# Altium schematic sheet HS-IO ESP32.SchDoc
size A3; SheetNumber: 3; SheetTotal: 3
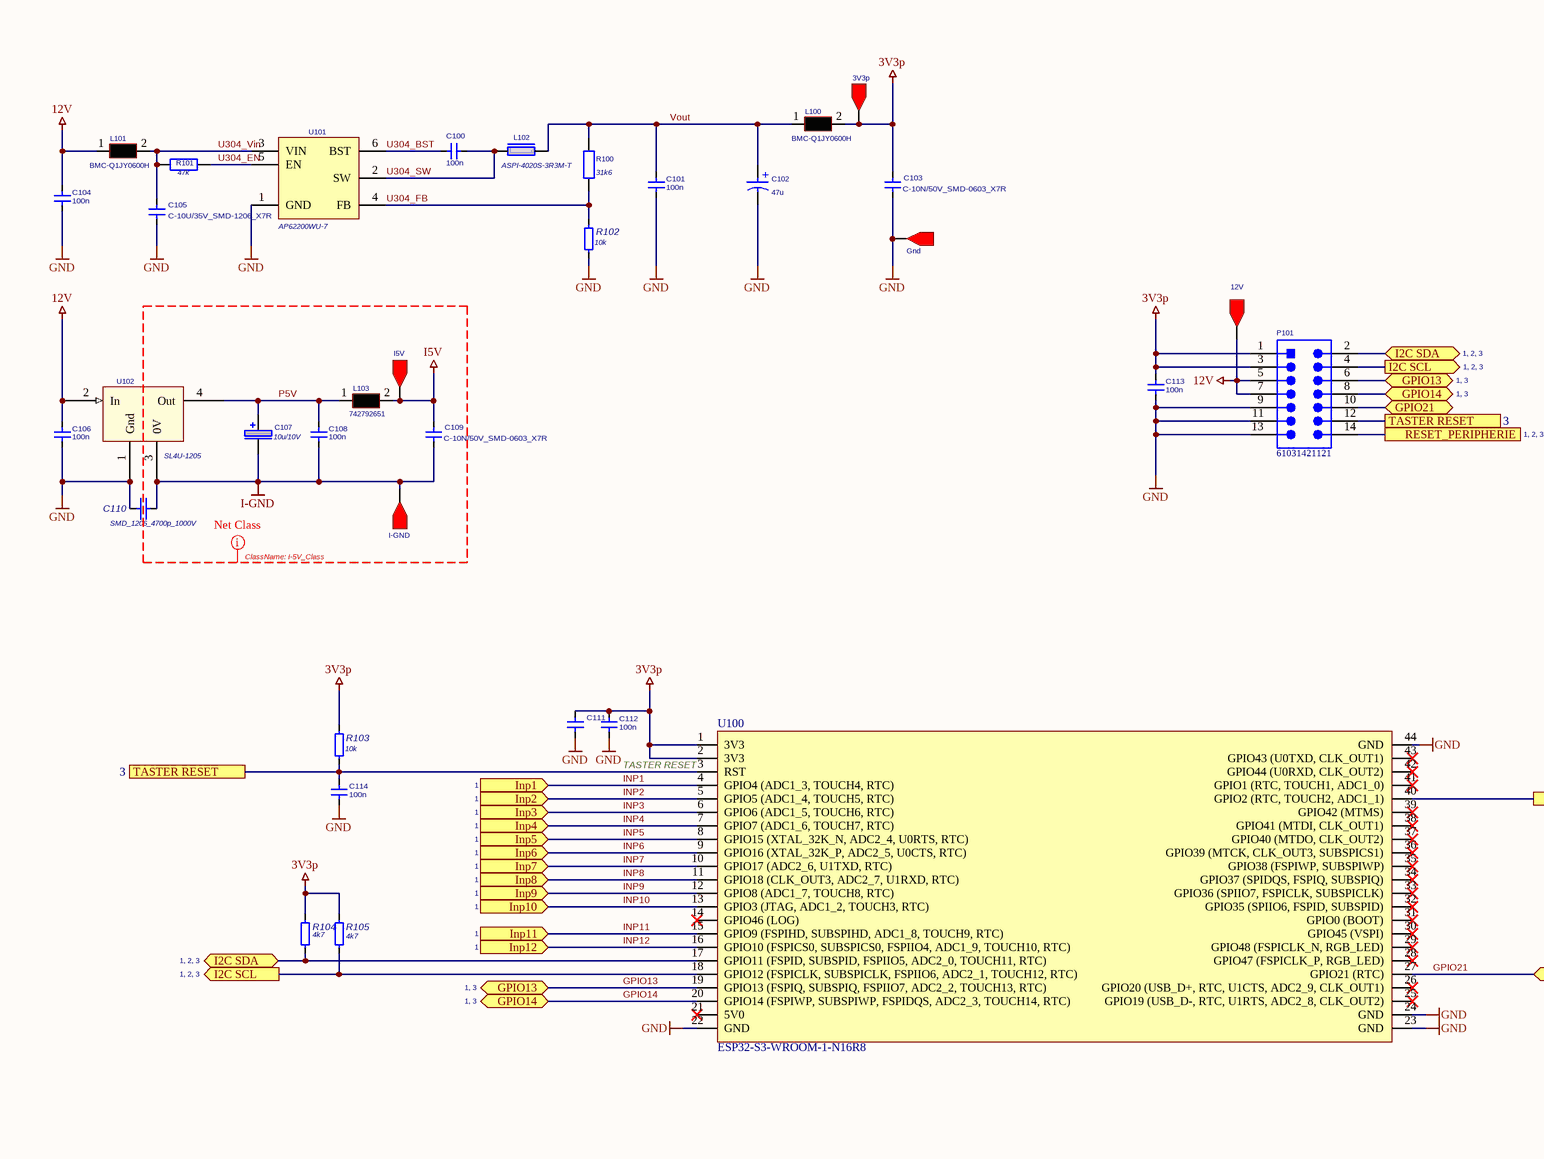
[diagram p0: HS-IO ESP32.SchDoc, left]
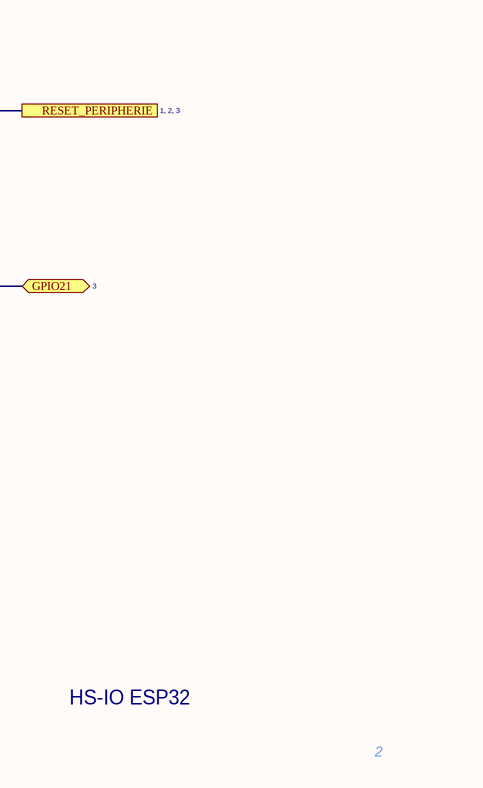
[diagram p1: HS-IO ESP32.SchDoc, right]

## Parts
3V3p  (no part)  [TESTPOINT]  (value not drawn)  (no BOM)
12V  (no part)  [TESTPOINT]  (value not drawn)  (no BOM)
C100  100n  [CC1608-0603]
C101  100n  [CC1608-0603]
C102  47u  [WCAP-PSLP_D5H5.5]
C103  C-10N/50V_SMD-0603_X7R  [0603_SMD_T]
C104  100n  [CC1608-0603]
C105  C-10U/35V_SMD-1206_X7R  [1206C_H0175_SMD_T]
C106  100n  [CC1608-0603]
C107  10u/10V  [TA-C]
C108  100n  [CC1608-0603]
C109  C-10N/50V_SMD-0603_X7R  [0603_SMD_T]
C110  SMD_1206_4700p_1000V  [CR3216-1206]
C111  C-10U/10V_SMD-0603_X5R  [CC1608-0603]  (value not drawn)
C112  100n  [CC1608-0603]
C113  100n  [CC1608-0603]
C114  100n  [CC1608-0603]
Gnd  (no part)  [TESTPOINT]  (value not drawn)  (no BOM)
I5V  (no part)  [TESTPOINT]  (value not drawn)  (no BOM)
I-GND  (no part)  [TESTPOINT]  (value not drawn)  (no BOM)
L100  BMC-Q1JY0600H  [0603-Ferrit]
L101  BMC-Q1JY0600H  [0603-Ferrit]
L102  ASPI-4020S-3R3M-T  [ASPI-4020S]
L103  742792651  [0603-Ferrit]
P101  61031421121  [61031421121]
R100  31k6  [CR1608-0603]
R101  47k  [CR1608-0603]
R102  10k  [CR1608-0603]
R103  10k  [CR1608-0603]
R104  4k7  [CC1608-0603]
R105  4k7  [CC1608-0603]
U100  ESP32-S3-WROOM-1-N16R8  [DIL-44-ESP32]
U101  AP62200WU-7  [SOT95P280X100-6N]
U102  SL4U-1205  [SIP4_6mm]

## Ports
GPIO13 (bidir, see 1, 3), GPIO14 (bidir, see 1, 3), GPIO21 (bidir, see 3), I2C SCL (out, see 1, 2, 3), I2C SDA (bidir, see 1, 2, 3), Inp1 (in, see 1), Inp2 (in, see 1), Inp3 (in, see 1), Inp4 (in, see 1), Inp5 (in, see 1), Inp6 (in, see 1), Inp7 (in, see 1), Inp8 (in, see 1), Inp9 (in, see 1), Inp10 (in, see 1), Inp11 (in, see 1), Inp12 (in, see 1), RESET_PERIPHERIE (see 1, 2, 3), TASTER RESET (see 3)

## Nets
3V3p: 3V3p.1 C103.1 C111.1 C112.2 C113.2 L100.2 P101.1 P101.3 R103.2 R104.2 R105.2 U100.1(3V3) U100.2(3V3)
12V: 12V.1 C104.1 C106.2 L101.1 P101.5 P101.7 U102.2(In)
GND: C101.1 C102.2(N) C103.2 C104.2 C105.2 C106.1 C110.1 C111.2 C112.1 C113.1 C114.1 Gnd.1 P101.9 P101.11 P101.13 R102.1 U100.22(GND) U100.23(GND) U100.24(GND) U100.44(GND) U101.1(GND) U102.1(Gnd)
I5V: C109.1 I5V.1 L103.2
I-GND: C107.2 C108.1 C109.2 C110.2 I-GND.1 U102.3(0V)
GPIO13: P101.6 U100.19(GPIO13_(FSPIQ,_SUBSPIQ,_FSPIIO7,_ADC2_2,_TOUCH13,_RTC)) ; port GPIO13
GPIO14: P101.8 U100.20(GPIO14_(FSPIWP,_SUBSPIWP,_FSPIDQS,_ADC2_3,_TOUCH14,_RTC)) ; port GPIO14
GPIO21: P101.10 U100.27(GPIO21_(RTC)) ; port GPIO21
I2C SCL: P101.4 R105.1 U100.18(GPIO12_(FSPICLK,_SUBSPICLK,_FSPIIO6,_ADC2_1,_TOUCH12,_RTC)) ; port I2C SCL
I2C SDA: P101.2 R104.1 U100.17(GPIO11_(FSPID,_SUBSPID,_FSPIIO5,_ADC2_0,_TOUCH11,_RTC)) ; port I2C SDA
INP1: U100.4(GPIO4_(ADC1_3,_TOUCH4,_RTC)) ; port Inp1
INP2: U100.5(GPIO5_(ADC1_4,_TOUCH5,_RTC)) ; port Inp2
INP3: U100.6(GPIO6_(ADC1_5,_TOUCH6,_RTC)) ; port Inp3
INP4: U100.7(GPIO7_(ADC1_6,_TOUCH7,_RTC)) ; port Inp4
INP5: U100.8(GPIO15_(XTAL_32K_N,_ADC2_4,_U0RTS,_RTC)) ; port Inp5
INP6: U100.9(GPIO16_(XTAL_32K_P,_ADC2_5,_U0CTS,_RTC)) ; port Inp6
INP7: U100.10(GPIO17_(ADC2_6,_U1TXD,_RTC)) ; port Inp7
INP8: U100.11(GPIO18_(CLK_OUT3,_ADC2_7,_U1RXD,_RTC)) ; port Inp8
INP9: U100.12(GPIO8_(ADC1_7,_TOUCH8,_RTC)) ; port Inp9
INP10: U100.13(GPIO3_(JTAG,_ADC1_2,_TOUCH3,_RTC)) ; port Inp10
INP11: U100.15(GPIO9_(FSPIHD,_SUBSPIHD,_ADC1_8,_TOUCH9,_RTC)) ; port Inp11
INP12: U100.16(GPIO10_(FSPICS0,_SUBSPICS0,_FSPIIO4,_ADC1_9,_TOUCH10,_RTC)) ; port Inp12
P5V: C107.1 C108.2 L103.1 U102.4(Out)
RESET_PERIPHERIE: P101.14 U100.40(GPIO2_(RTC,_TOUCH2,_ADC1_1)) ; port RESET_PERIPHERIE
TASTER RESET: C114.2 P101.12 R103.1 U100.3(RST) ; port TASTER RESET
U304_BST: C100.1 U101.6(BST)
U304_EN: R101.1 U101.5(EN)
U304_FB: R100.1 R102.2 U101.4(FB)
U304_SW: C100.2 L102.1 U101.2(SW)
U304_Vin: C105.1 L101.2 R101.2 U101.3(VIN)
Vout: C101.2 C102.1(P) L100.1 L102.2 R100.2

Not connected (* = marked no-connect by the designer): U100 14(GPIO46_(LOG))* 21(5V0)* 25(GPIO19_(USB_D-,_RTC,_U1RTS,_ADC2_8,_CLK_OUT2))* 26(GPIO20_(USB_D+,_RTC,_U1CTS,_ADC2_9,_CLK_OUT1))* 28(GPIO47_(FSPICLK_P,_RGB_LED))* 29(GPIO48_(FSPICLK_N,_RGB_LED))* 30(GPIO45_(VSPI))* 31(GPIO0_(BOOT))* 32(GPIO35_(SPIIO6,_FSPID,_SUBSPID))* 33(GPIO36_(SPIIO7,_FSPICLK,_SUBSPICLK))* 34(GPIO37_(SPIDQS,_FSPIQ,_SUBSPIQ))* 35(GPIO38_(FSPIWP,_SUBSPIWP))* 36(GPIO39_(MTCK,_CLK_OUT3,_SUBSPICS1))* 37(GPIO40_(MTDO,_CLK_OUT2))* 38(GPIO41_(MTDI,_CLK_OUT1))* 39(GPIO42_(MTMS))* 41(GPIO1_(RTC,_TOUCH1,_ADC1_0))* 42(GPIO44_(U0RXD,_CLK_OUT2))* 43(GPIO43_(U0TXD,_CLK_OUT1))*

## Layout directives
net class I-5V_Class: I5V, I-GND, P5V

## Notes on the sheet
- HS-IO ESP32
- 2
- (in symbol CMP-001-00009-1) +

## Library data of the parts
3V3p 12V Gnd I5V I-GND = CMP-029-000001-1: Test Point; Manufacturer: (no part); Manufacturer Part Number: (no part); Supplier Order Number: (no part); Supplier Price 100pcs: (no part); Kommentar: (no part); E01_Value_1: (no part); Supplier: Mouser
C100 C101 C104 C106 C108 C112-C114 = CMP-018-000010-5: SMD0603, X7R, 15%, 50V, 100nF; Manufacturer: KEMET; Manufacturer Part Number: C0603C104K5RAC7867; Kommentar: Kondensator aus mehreren Keramikschichten MLCC - SMD/SMT 50V 0.1uF X7R 0603 10%; Supplier Order Number: 80-C0603C104K5R7867; Supplier Price 100pcs: 0,022 €; ComponentLink2URL: https://www.mouser.de/datasheet/2/447/KEM_C1002_X7R_SMD-3316098.pdf; Supplier: Mouser; ComponentLink1Description: Manufacturer Link; E01_Value_1: 100n; ComponentLink2Description: Datasheet; ComponentLink1URL: https://www.kemet.com
C102 = CMP-001-00009-1: WCAP-PSLP Aluminum Polymer Capacitor, V-Chip SMT, D5 x H5.5mm, 47µF, 6.3V; Manufacturer Part Number: 875105142001; Manufacturer: Wurth Elektronik; ComponentLink1URL: https://www.we-online.com/redexpert/article/875105142001?ad; ComponentLink1Description: Website Link; ComponentLink2URL: https://www.we-online.com/redexpert/spec/875105142001?ad; ComponentLink2Description: Datasheet Link; Supplier Order Number: 710-875105142001; Supplier: Mouser
C103 C109 = CMP-046-000011-6: C 10N/50V, SMD-0603, X7R; Manufacturer: AVX GMBH; Manufacturer Part Number: 06035C103KAT2A; Supplier Order Number: 581-06035C103K; Supplier: Mouser
C105 = CMP-046-000013-5: Kondensator, MLCC, SMD 1206, 35V, 10uF, X7R,  10%; Manufacturer: TAIYO YUDEN EUR; Manufacturer Part Number: GMK316AB7106KL-TR; Supplier Price 100pcs: 0,176 €; Supplier Order Number: 963-GMK316AB7106KL; E01_Value_1: 10u/35V; Supplier: Mouser
C107 = SMD_TAA_10u_1: Tantal Elko 10uF / 10V; Manufacturer: KEMET; Manufacturer Part Number: T491C106K010AT; Kommentar: Tantalkondensatoren - fest für SMD 10V 10uF 2312 10% ESR=1.8 Ohms; ComponentLink1Description: Manufacturer Link; ComponentLink1URL: https://www.kemet.com; ComponentLink2Description: Datasheet; ComponentLink2URL: https://www.mouser.de/datasheet/2/447/KEM_T2005_T491-3316937.pdf; E01_Value_1: 10u/10V; Supplier: Mouser; Supplier Order Number: 80-T491C106K010; Supplier Price 100pcs: 0,209 €
C110 = CMP-001-00069-1: Multilayer Ceramic Capacitors MLCC - SMD/SMT 1kV 4700pF X7R 1206 10%; Manufacturer: YAGEO; Manufacturer Part Number: CC1206KKX7RCBB472; E01_Value_1: 4700p; Supplier Price 100pcs: 0,135 €; Supplier: Mouser; ComponentLink1Description: Manufacturer Link; ComponentLink2URL: https://www.mouser.de/datasheet/2/447/UPY_GPHC_X7R_6_3V_to_250V_24-3441574.pdf; ComponentLink1URL: https://www.yageo.com/en/Home; Supplier Order Number: 603-CC126KKX7RCBB472; ComponentLink2Description: Datasheet
C111 = CMP-066-000007-6: Manufacturer: TDK ELECTRONICS; Manufacturer Part Number: C1608X5R1A106M080AC; E01_Value_1: 10u; Supplier: Mouser; Supplier Order Number: 810-C1608X5R1A106M
L100 L101 = CMP-006-00001-3: Ferritperlen BMC-Q 0603 600R 25% Tol. High Current; Manufacturer: TE Connectivity; Supplier Price 100pcs: 0,095 €; Supplier: Mouser; Supplier Order Number: 710-742862160; Manufacturer Part Number: BMC-Q1JY0600H; Kommentar: Ferritperlen BMC-Q 0603 600R 25% Tol. High Current; ComponentLink1Description: Datasheet Link; ComponentLink1URL: https://www.mouser.de/datasheet/2/418/9/ENG_DS_1773178_3_A1-3474112.pdf
L102 = ASPI-4020S-3R3M-T: FIXED IND 3.3UH 1.34A 75MOHM SMD; Manufacturer: ABRACON; Kommentar: Leistungsinduktivitäten – SMD FIXED IND 3.3UH 1.4A 70 MOHM SMD; ComponentLink1Description: Manufacturer Link; ComponentLink1URL: https://abracon.com/; ComponentLink2Description: Datasheet; ComponentLink2URL: https://www.mouser.de/datasheet/2/3/ASPI-4020S-1775177.pdf; E01_Value_1: ASPI-4020S-3R3M-T; Manufacturer Part Number: ASPI-4020S-3R3M-T; Supplier: Mouser; Supplier Order Number: 815-ASPI-4020S-3R3MT; Supplier Price 100pcs: 0,143 €
L103 = CMP-006-00002-1: Ferritperlen WE-CBF 0603 100MHz 600Ohm 1000mA AEC-Q200; Manufacturer: Würth; E01_Value_1: 600Ohm, 1A; Supplier Price 100pcs: 0,157 €; Supplier: Mouser; Supplier Order Number: 710-742792651; Manufacturer Part Number: 742792651; Kommentar: Ferritperlen WE-CBF 0603 100MHz 600Ohm 1000mA AEC-Q200; ComponentLink1Description: Datasheet Link; ComponentLink1URL: https://www.we-online.com/components/products/datasheet/742792651.pdf
P101 = CMP-067-000001-1: WR-PHD Pin Header, SMT, pitch 2.54mm, Dual Row, Vertical, 14p; Manufacturer: Wurth Elektronik; Supplier Order Number: 710-61031421121; Manufacturer Part Number: 61031421121; Supplier: Mouser
R100 = S0603_31k6_1: SMD0603, 0.1W, TK100, 1%, 31.6k; Manufacturer: Vishay / Dale; Manufacturer Part Number: CRCW060331K6FKEAC; Kommentar: Dickfilmwiderstände - SMD 1/10W 31.6Kohms 1% Commercial Use; ComponentLink1Description: Manufacturer Link; ComponentLink1URL: https://www.vishay.com/; ComponentLink2Description: Datasheet; ComponentLink2URL: https://www.vishay.com/docs/20035/dcrcwe3.pdf; E01_Value_1: 31k6; Supplier: Mouser; Supplier Order Number: 71-CRCW060331K6FKEAC; Supplier Price 100pcs: 0,008 €
R101 = S0603_47k: RES 47K OHM 1% 1/10W 0603; Manufacturer: Vishay / Dale; Manufacturer Part Number: CRCW060347K0FKED; Kommentar: Dickfilmwiderstände - SMD D11/CRCW0603 100 47K 1% ET3 E3; ComponentLink1Description: Manufacturer Link; ComponentLink2Description: Datasheet; ComponentLink2URL: https://www.vishay.com/doc?28773; Supplier: Mouser; Supplier Order Number: 71-CRCW060347K0FKED; Supplier Price 100pcs: 0,012 €; E01_Value_1: 47k; ComponentLink1URL: https://www.vishay.com/
R102 R103 = CMP-027-000005-4: SMD0603, 0.1W, TK100, 1%, 10k; Manufacturer: Vishay / Dale; Manufacturer Part Number: CRCW060310K0FKEAC; Kommentar: Dickfilmwiderstände - SMD 1/10Watt 10Kohms 1% Commercial Use; Supplier Price 100pcs: 0,011 €; Supplier Order Number: 71-CRCW060310K0FKEAC; ComponentLink1Description: Manufacturer Link; ComponentLink2Description: Datasheet; ComponentLink2URL: https://www.vishay.com/docs/20035/dcrcwe3.pdf; E01_Value_1: 10K; ComponentLink1URL: https://www.vishay.com/; Supplier: Mouser
R104 R105 = CMP-038-000005-4: Dünnfilmwiderstände - SMD .1W 4.7Kohms 1% 0603 50ppm Auto; Manufacturer Part Number: MCT06030C4701FP500; Manufacturer: Vishay / Beyschlag; ComponentLink2URL: https://www.vishay.com/docs/28700/mcx0x0xpre.pdf; E01_Value_1: 4k7; Kommentar: Dünnfilmwiderstände - SMD .1W 4.7Kohms 1% 0603 50ppm Auto; ComponentLink1Description: Manufacturer Link; ComponentLink1URL: https://www.mouser.de/manufacturer/beyschlag/; Supplier Price 100pcs: 0,025 €; ComponentLink2Description: Datasheet; Supplier Order Number: 594-MCT06030C4701FP5; Supplier: Mouser
U100 = CMP-020-00001-8: SMD mod, ESP32-S3R8 with 3.3V, 8MB Octal PSRAM die insid, 6MBQuad SPI flash, pcb ant; Min Supply Voltage: 3V; Max Supply Voltage: 3.6V; Min Operating Temperature: -40°C; Max Operating Temperature: 65°C
U101 = AP62200WU-7: 4.2V TO 18V INPUT, 2A LOW IQ SYNCHRONOUS BUCK CONVERTER; Manufacturer: Diodes Incorporated; Kommentar: Schaltspannungsregler DCDC Conv HV Buck TSOT26(STD) T&R 3K; ComponentLink1Description: Manufacturer Link; ComponentLink2Description: Datasheet; ComponentLink2URL: https://www.mouser.de/datasheet/2/115/AP62200_AP62201_AP62200T-3194967.pdf; E01_Value_1: AP62200WU-7; ComponentLink1URL: https://www.diodes.com/; Manufacturer Part Number: AP62200WU-7; Supplier: Mouser; Supplier Order Number: 621-AP62200WU-7; Supplier Price 100pcs: 0,228 €
U102 = SL4U-1205: DC/DC Wandler 1W 12V/5V Isolation 1000V; Manufacturer: Floeth Electronic; Kommentar: DC-DC-Converter 12V zu 5V, 200mA; ComponentLink1Description: Manufacturer Link; ComponentLink1URL: www.floeth-electronic.com; ComponentLink2Description: Datasheet; ComponentLink2URL: https://floeth-electronic.com/wordpress/wp-content/uploads/2021/07/Seite-101-SL4U.pdf; E01_Value_1: SL4U-1205; Manufacturer Part Number: SL4U-1205; Supplier: Mouser; Supplier Order Number: SL4U-1205